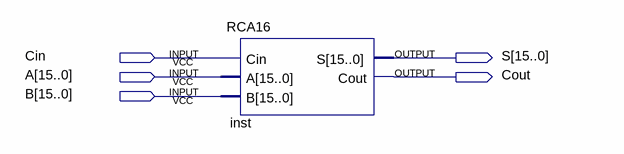
[diagram p0: schematic sheet]
// Quartus schematic RCA16bits.bdf as structural Verilog: 1 symbols, 5 pins
module RCA16bits (
  input  Cin,
  input  [15:0] A,
  input  [15:0] B,
  output [15:0] S,
  output Cout
);

  RCA16 inst (.Cin(Cin), .A(A), .B(B), .S(S), .Cout(Cout));
endmodule
